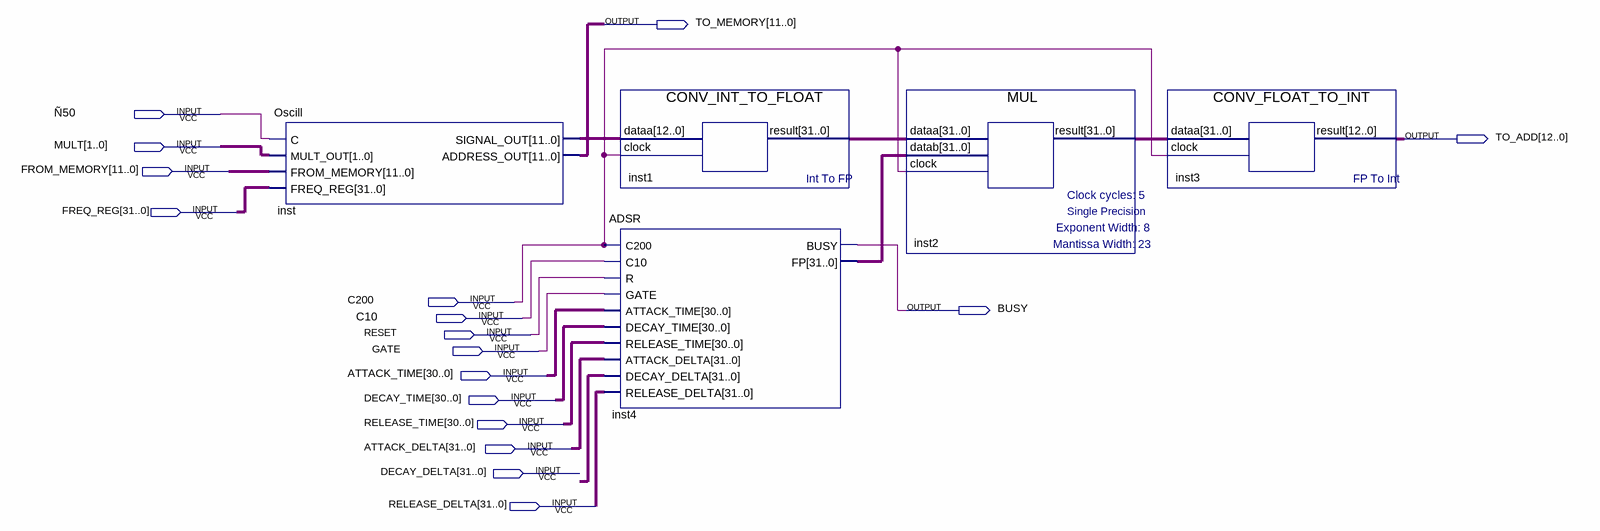
[diagram p0: schematic sheet]
// Quartus schematic BLOCK.bdf as structural Verilog: 5 symbols, 17 pins
module BLOCK (
  input  \Ñ50 ,
  input  [1:0] MULT,
  input  [11:0] FROM_MEMORY,
  input  [31:0] FREQ_REG,
  input  C200,
  input  C10,
  input  RESET,
  input  GATE,
  input  [30:0] ATTACK_TIME,
  input  [30:0] DECAY_TIME,
  input  [30:0] RELEASE_TIME,
  input  [31:0] ATTACK_DELTA,
  input  [31:0] DECAY_DELTA,
  input  [31:0] RELEASE_DELTA,
  output [11:0] TO_MEMORY,
  output [12:0] TO_ADD,
  output BUSY
);

  wire [12:0] inst_signal_out;
  wire [31:0] inst1_result, inst2_result, inst4_fp, undriven;

  Oscill inst (
    .C(\Ñ50 ), .MULT_OUT(MULT), .FROM_MEMORY(FROM_MEMORY), .FREQ_REG(FREQ_REG), .SIGNAL_OUT(inst_signal_out),
    .ADDRESS_OUT(TO_MEMORY));
  CONV_INT_TO_FLOAT inst1 (.dataa(inst_signal_out), .clock(C200), .result(inst1_result));
  ADSR inst4 (
    .C200(C200), .C10(C10), .R(RESET), .GATE(GATE), .ATTACK_TIME(ATTACK_TIME), .DECAY_TIME(DECAY_TIME),
    .RELEASE_TIME(RELEASE_TIME), .ATTACK_DELTA(ATTACK_DELTA), .DECAY_DELTA(undriven),
    .RELEASE_DELTA(RELEASE_DELTA), .BUSY(BUSY), .FP(inst4_fp));
  MUL inst2 (.dataa(inst1_result), .datab(inst4_fp), .clock(C200), .result(inst2_result));
  CONV_FLOAT_TO_INT inst3 (.dataa(inst2_result), .clock(C200), .result(TO_ADD));
endmodule
